# Altium schematic sheet BU.14-AT10.SchDoc
size A4; SheetNumber: 1; SheetTotal: 1
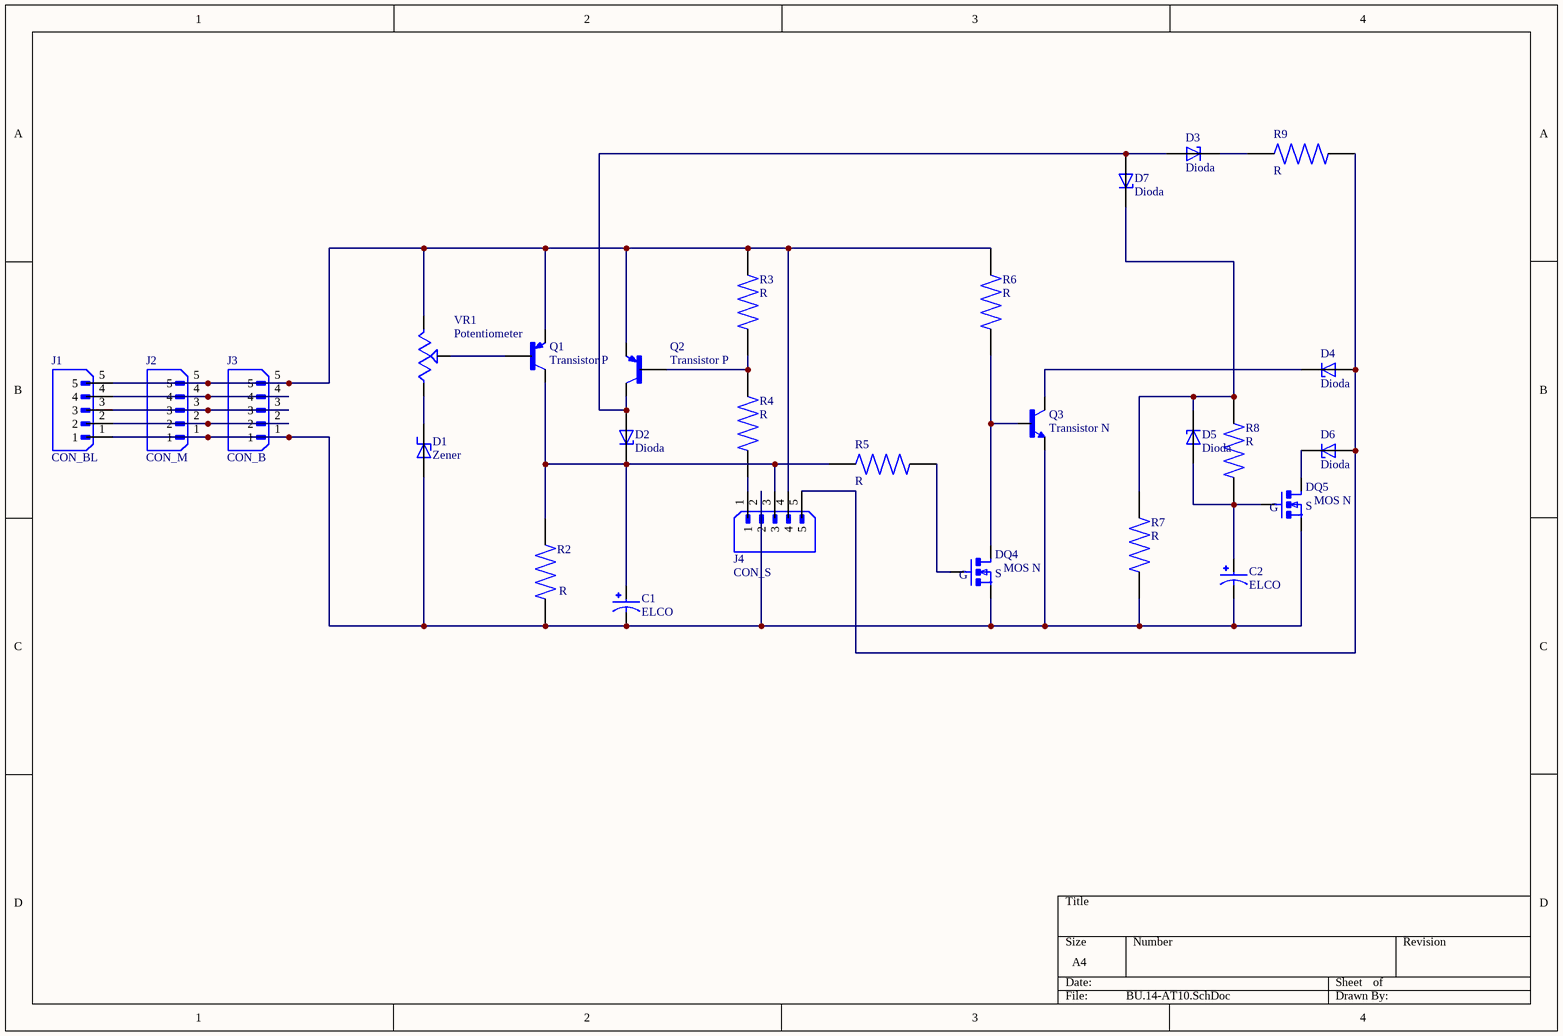
[diagram p0: BU.14-AT10.SchDoc]

## Parts
C1  ELCO  [10mmELCO]
C2  ELCO  [10mmELCO]
D1  Zener  [Zener]
D2  Dioda  [1N4148 - duplicate]
D3  Dioda  [1N4148 - duplicate]
D4  Dioda  [1N4148 - duplicate]
D5  Dioda  [1N4148 - duplicate]
D6  Dioda  [1N4148 - duplicate]
D7  Dioda  [1N4148 - duplicate]
J1  CON_BL  [5POS2.1mm]
J2  CON_M  [5POS2mm]
J3  CON_B  [5POS2mm]
J4  CON_S  [5POS2mm]
Q1  Transistor P  [TO-92]
Q2  Transistor P  [TO-92]
Q3  Transistor N  [TO-92]
Q4  MOS N  [TO-92]
Q5  MOS N  [TO-92]
R2  R  [DIP Resistor]
R3  R  [DIP Resistor]
R4  R  [DIP Resistor]
R5  R  [DIP Resistor]
R6  R  [DIP Resistor]
R7  R  [DIP Resistor]
R8  R  [DIP Resistor]
R9  R  [DIP Resistor]
VR1  Potentiometer  [Trimpot]

## Nets
NetC1_N: C1.N C2.N D1.A J1.1 J2.1 J3.1 J4.2 Q3.1(E) Q4.1(S) Q5.1(S) R2.1 R7.1
NetC1_P: C1.P D2.K(C) J4.3 Q1.3(C) R2.2 R5.1
NetC2_P: C2.P D5.A Q5.2(G) R8.1
NetD1_K: D1.K(C) VR1.3
NetD2_A: D2.A D3.A D7.A Q2.3(C)
NetD3_K: D3.K(C) R9.1
NetD4_A: D4.A D6.A J4.5 R9.2
NetD4_K: D4.K(C) Q3.3(C)
NetD5_K: D5.K(C) D7.K(C) R7.2 R8.2
NetD6_K: D6.K(C) Q5.3(D)
NetJ1_2: J1.2 J2.2 J3.2
NetJ1_3: J1.3 J2.3 J3.3
NetJ1_4: J1.4 J2.4 J3.4
NetJ1_5: J1.5 J2.5 J3.5 J4.4 Q1.1(E) Q2.1(E) R3.2 R6.2 VR1.1
NetJ4_1: J4.1 R4.1
NetQ1_2: Q1.2(B) VR1.2
NetQ2_2: Q2.2(B) R3.1 R4.2
NetQ3_2: Q3.2(B) Q4.3(D) R6.1
NetQ4_2: Q4.2(G) R5.2

## Library data of the parts
C1 C2 = ELCO: Cap Aluminum Lytic 22uF 10V 20% (4 X 7mm) Radial 1.5mm 30mA 1000h 105C Bulk; MF: Panasonic; MP: EEA-GA1A220; Price: None; Purchase-URL: https://pricing.snapeda.com/search/part/EEA-GA1A220/?ref=eda; Availability: In Stock; Value: *; SnapEDA_Link: https://www.snapeda.com/parts/EEA-GA1A220/Panasonic/view-part/454477/?ref=snap; Check_prices: https://www.snapeda.com/parts/EEA-GA1A220/Panasonic/view-part/454477/?ref=eda; Package: RADIAL-2 Panasonic
D1 = Zener: MP: P6KE36A; Package: None; Price: None; Value: *; Availability: Unavailable
D2-D7 = Dioda: MP: P6KE36A; Package: None; Price: None; Value: *; Availability: Unavailable
J1 = 5P JST 2.1: Connector Header Through Hole 5 position 0.098 (2.50mm); MF: JST Sales America Inc.; MP: B5B-XH-A(LF)(SN); SnapEDA_Link: https://www.snapeda.com/parts/B5B-XH-A(LF)(SN)/JST+Sales+America+Inc./view-part/?ref=snap; Package: None; Value: *; Check_prices: https://www.snapeda.com/parts/B5B-XH-A(LF)(SN)/JST+Sales+America+Inc./view-part/?ref=eda
J2-J4 = 5P JST 2.0: Connector Header Through Hole 5 position 0.098 (2.50mm); MF: JST Sales America Inc.; MP: B5B-XH-A(LF)(SN); SnapEDA_Link: https://www.snapeda.com/parts/B5B-XH-A(LF)(SN)/JST+Sales+America+Inc./view-part/?ref=snap; Package: None; Value: *; Check_prices: https://www.snapeda.com/parts/B5B-XH-A(LF)(SN)/JST+Sales+America+Inc./view-part/?ref=eda
Q1 Q2 = Transistor P: Transistor PNP 2SA1015/2SA1015Y TOSHIBA miliampere=150 V=50 TO92; MP: 2SA1015-Y; SnapEDA_Link: https://www.snapeda.com/parts/2SA1015-Y/Toshiba/view-part/?ref=snap; Package: TO-92 Toshiba; Value: *; MF: Toshiba; Check_prices: https://www.snapeda.com/parts/2SA1015-Y/Toshiba/view-part/?ref=eda
Q3 = Transistor N: TRANS NPN 40V 200MA TO92-3; MP: 2N3904; MF: Rectron; SnapEDA_Link: https://www.snapeda.com/parts/2N3904/Rectron/view-part/?ref=snap; Package: TO-226-3 Rectron; Check_prices: https://www.snapeda.com/parts/2N3904/Rectron/view-part/?ref=eda; Purchase-URL: https://pricing.snapeda.com/search/part/2N3904/?ref=eda; Price: None; Value: *; Availability: In Stock
Q4 Q5 = MOS N: MOSFET TO-220 N-CH 50V 30A; MF: STMicroelectronics; MP: BUZ71; SnapEDA_Link: https://www.snapeda.com/parts/BUZ71/STMicroelectronics/view-part/?ref=snap; Package: TO-220-3 STMicroelectronics; Value: *; Check_prices: https://www.snapeda.com/parts/BUZ71/STMicroelectronics/view-part/?ref=eda
R2-R9 = R: 1.33 kOhms Â±1% 0.25W, 1/4W Through Hole Resistor Axial Metal Film; MF: Yageo; MP: MFR-25FBF52-1K33; Arrow_Electronics-Purchase-URL: https://snapeda.com/shop?store=Arrow+Electronics&id=3223064; Mouser-Purchase-URL: https://snapeda.com/shop?store=Mouser&id=3223064; SnapEDA_Link: https://www.snapeda.com/parts/MFR-25FBF52-1K33/Yageo/view-part/3223064/?ref=snap; DigiKey-Purchase-URL: https://snapeda.com/shop?store=DigiKey&id=3223064; Package: Axial Yageo; Value: *
VR1 = Potentiometer: 10 mm, Vertical, Logarithmic, 50 kÎ©, Through Hole, D-cut Rotary Potentiometer; MF: Same Sky; MP: PT01-D225D-A503; SnapEDA_Link: https://www.snapeda.com/parts/PT01-D225D-A503/Same+Sky/view-part/?ref=snap; Package: None; Value: *; Check_prices: https://www.snapeda.com/parts/PT01-D225D-A503/Same+Sky/view-part/?ref=eda